# Altium schematic sheet Left.SchDoc
size A3; SheetNumber: 1; SheetTotal: 1
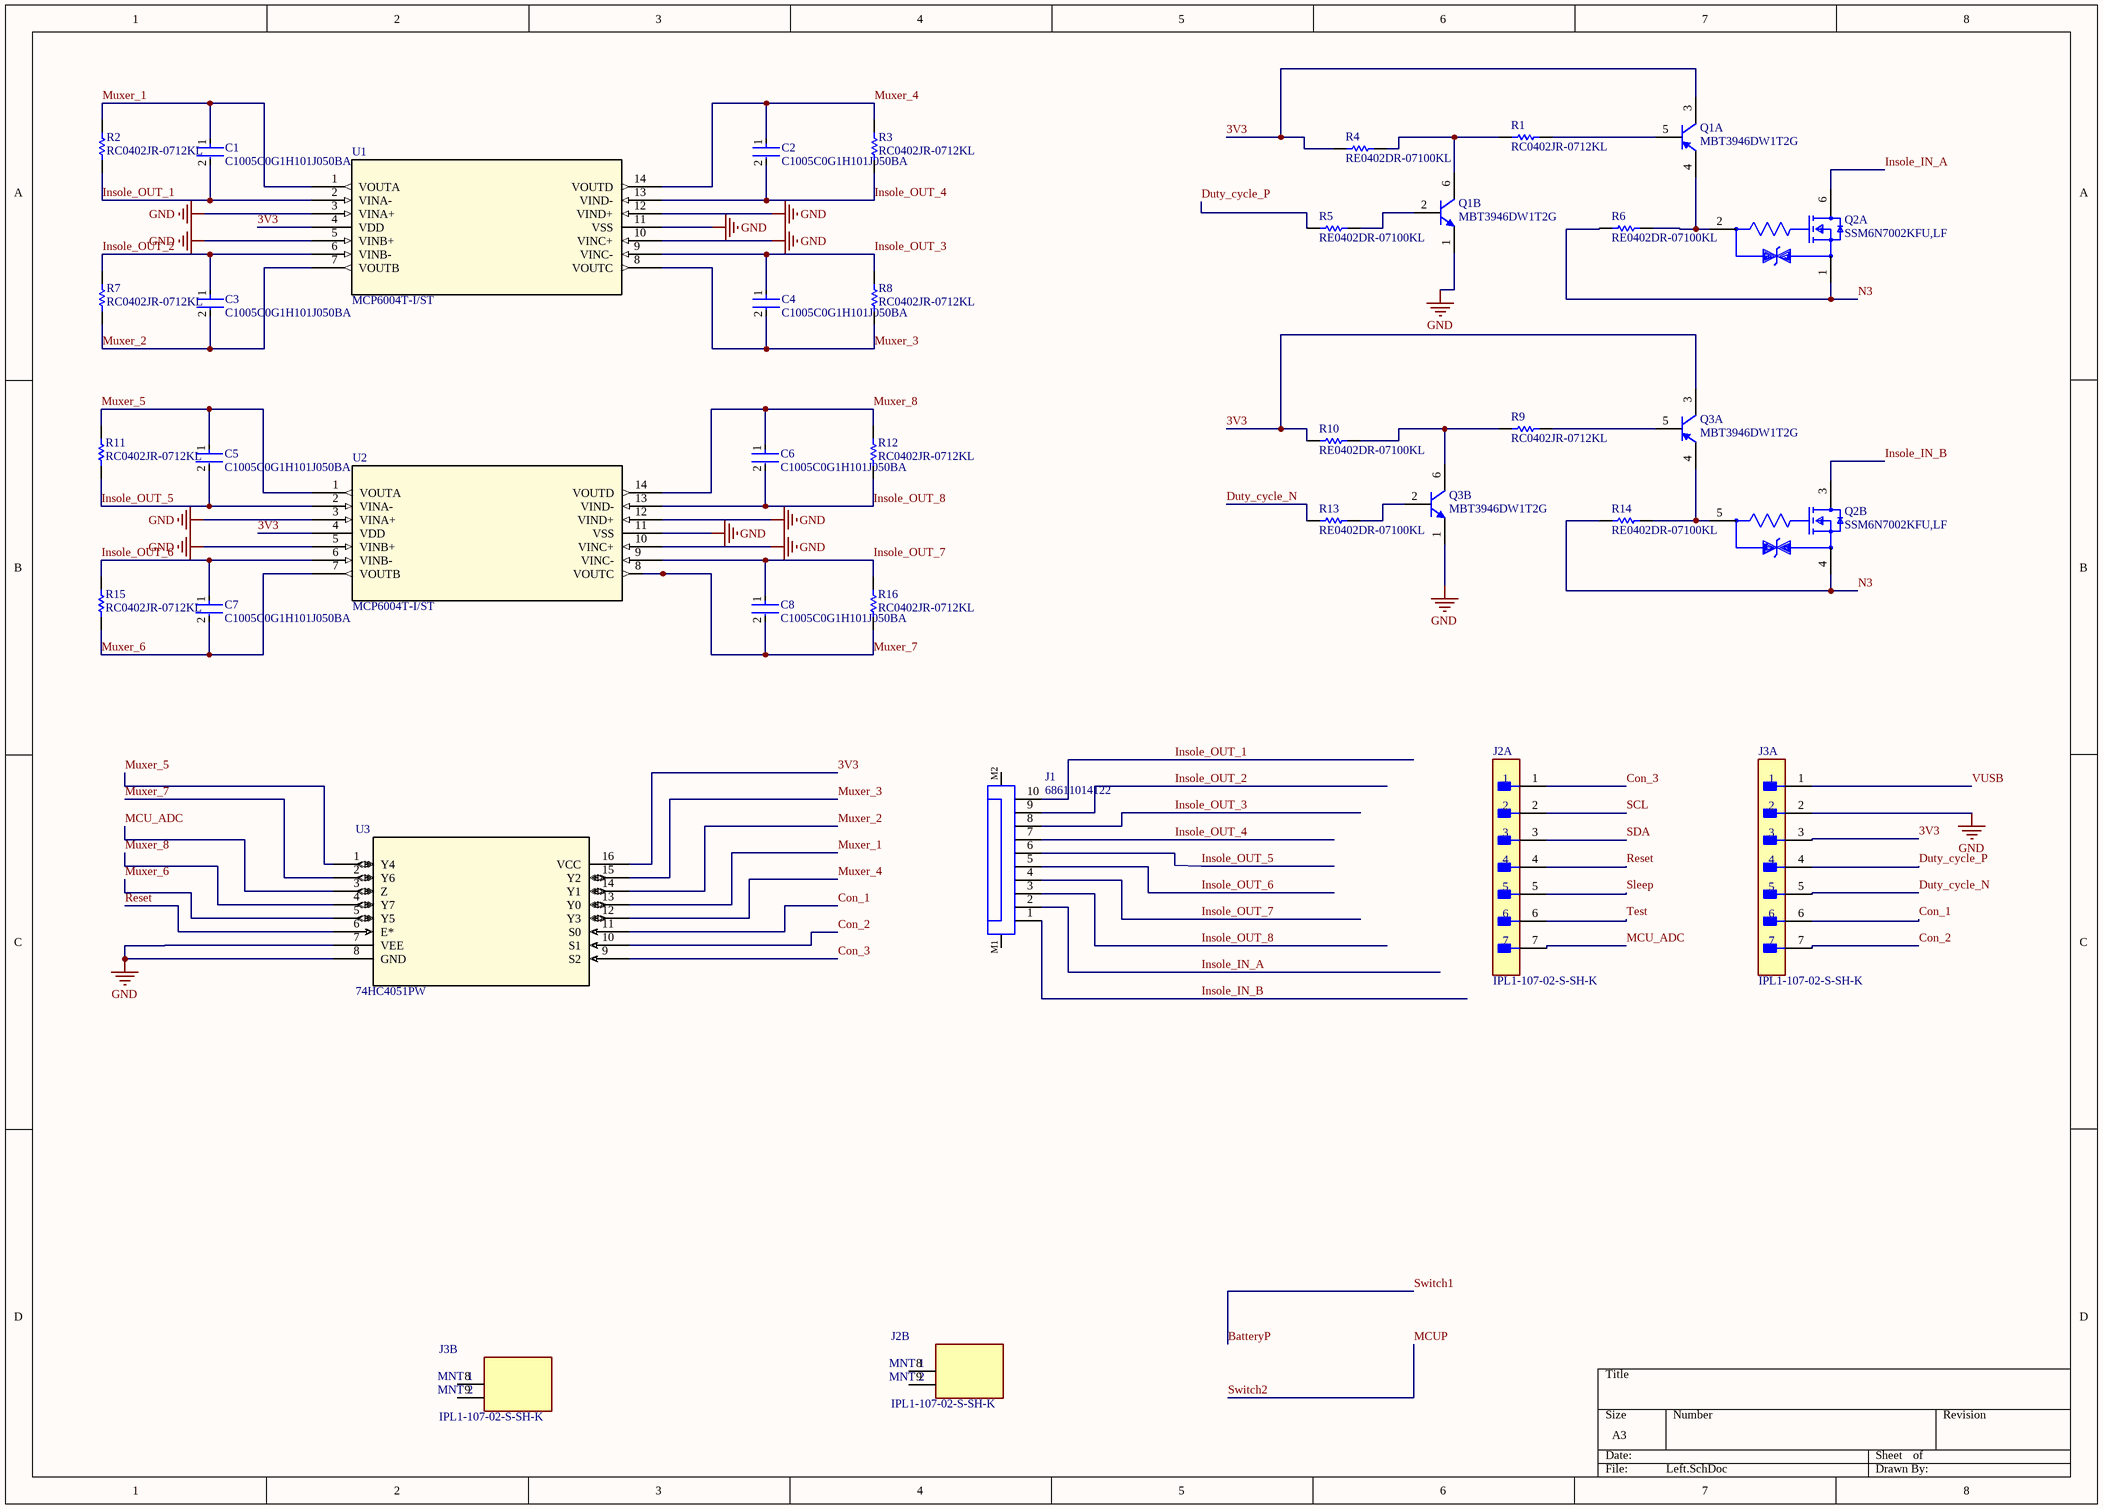
[diagram p0: Left.SchDoc]

## Parts
C1  C1005C0G1H101J050BA  [FP-C1005-050-0_05-MFG]
C2  C1005C0G1H101J050BA  [FP-C1005-050-0_05-MFG]
C3  C1005C0G1H101J050BA  [FP-C1005-050-0_05-MFG]
C4  C1005C0G1H101J050BA  [FP-C1005-050-0_05-MFG]
C5  C1005C0G1H101J050BA  [FP-C1005-050-0_05-MFG]
C6  C1005C0G1H101J050BA  [FP-C1005-050-0_05-MFG]
C7  C1005C0G1H101J050BA  [FP-C1005-050-0_05-MFG]
C8  C1005C0G1H101J050BA  [FP-C1005-050-0_05-MFG]
J1  68611014122  [68611014122]
J2  IPL1-107-02-S-SH-K  [FP-IPL1-107-02-S-SH-K-0]  (parts A,B of 2)
J3  IPL1-107-02-S-SH-K  [FP-IPL1-107-02-S-SH-K-0]  (parts A,B of 2)
Q1  MBT3946DW1T2G  [ONSC-SC70-6-419B-02_W_V]  (parts A,B of 2)
Q2  SSM6N7002KFU,LF  [FP-SSOP6-P-0_65A-MFG]  (parts A,B of 2)
Q3  MBT3946DW1T2G  [ONSC-SC70-6-419B-02_W_V]  (parts A,B of 2)
R1  RC0402JR-0712KL  [RESC1005X40X25NL05T10]
R2  RC0402JR-0712KL  [RESC1005X40X25NL05T10]
R3  RC0402JR-0712KL  [RESC1005X40X25NL05T10]
R4  RE0402DR-07100KL  [RESC1005X37X25ML05T10]
R5  RE0402DR-07100KL  [RESC1005X37X25ML05T10]
R6  RE0402DR-07100KL  [RESC1005X37X25ML05T10]
R7  RC0402JR-0712KL  [RESC1005X40X25NL05T10]
R8  RC0402JR-0712KL  [RESC1005X40X25NL05T10]
R9  RC0402JR-0712KL  [RESC1005X40X25NL05T10]
R10  RE0402DR-07100KL  [RESC1005X37X25ML05T10]
R11  RC0402JR-0712KL  [RESC1005X40X25NL05T10]
R12  RC0402JR-0712KL  [RESC1005X40X25NL05T10]
R13  RE0402DR-07100KL  [RESC1005X37X25ML05T10]
R14  RE0402DR-07100KL  [RESC1005X37X25ML05T10]
R15  RC0402JR-0712KL  [RESC1005X40X25NL05T10]
R16  RC0402JR-0712KL  [RESC1005X40X25NL05T10]
U1  MCP6004T-I/ST  [TSSOP14_MC_MCH]
U2  MCP6004T-I/ST  [TSSOP14_MC_MCH]
U3  74HC4051PW  [SOT403-1_NXP]

## Nets
GND: J3.2 Q1.1(E) Q3.1(E) U1.3(VINA+) U1.5(VINB+) U1.10(VINC+) U1.11(VSS) U1.12(VIND+) U2.3(VINA+) U2.5(VINB+) U2.10(VINC+) U2.11(VSS) U2.12(VIND+) U3.7(VEE) U3.8(GND)
3V3: J3.3 Q1.3(C) Q3.3(C) R4.2 R10.2 U1.4(VDD) U2.4(VDD) U3.16(VCC)
Con_1: J3.6 U3.11(S0)
Con_2: J3.7 U3.10(S1)
Con_3: J2.1 U3.9(S2)
Duty_cycle_N: J3.5 R13.2
Duty_cycle_P: J3.4 R5.2
Insole_IN_A: J1.2 Q2.6(Drain1)
Insole_IN_B: J1.1 Q2.3(Drain2)
Insole_OUT_1: C1.2 J1.10 R2.1 U1.2(VINA-)
Insole_OUT_2: C3.1 J1.9 R7.2 U1.6(VINB-)
Insole_OUT_3: C4.1 J1.8 R8.2 U1.9(VINC-)
Insole_OUT_4: C2.2 J1.7 R3.1 U1.13(VIND-)
Insole_OUT_5: C5.2 J1.6 R11.1 U2.2(VINA-)
Insole_OUT_6: C7.1 J1.5 R15.2 U2.6(VINB-)
Insole_OUT_7: C8.1 J1.4 R16.2 U2.9(VINC-)
Insole_OUT_8: C6.2 J1.3 R12.1 U2.13(VIND-)
MCU_ADC: J2.7 U3.3(Z)
Muxer_1: C1.1 R2.2 U1.1(VOUTA) U3.13(Y0)
Muxer_2: C3.2 R7.1 U1.7(VOUTB) U3.14(Y1)
Muxer_3: C4.2 R8.1 U1.8(VOUTC) U3.15(Y2)
Muxer_4: C2.1 R3.2 U1.14(VOUTD) U3.12(Y3)
Muxer_5: C5.1 R11.2 U2.1(VOUTA) U3.1(Y4)
Muxer_6: C7.2 R15.1 U2.7(VOUTB) U3.5(Y5)
Muxer_7: C8.2 R16.1 U2.8(VOUTC) U3.2(Y6)
Muxer_8: C6.1 R12.2 U2.14(VOUTD) U3.4(Y7)
N3: Q2.1(Source1) Q2.4(Source2) R6.2 R14.2
Reset: J2.4 U3.6(E*)
SCL: J2.2
SDA: J2.3
Sleep: J2.5
Test: J2.6
VUSB: J3.1
NetQ1_2: Q1.2(B) R5.1
NetQ1_4: Q1.4(E) Q2.2(Gate1) R6.1
NetQ1_5: Q1.5(B) R1.1
NetQ1_6: Q1.6(C) R1.2 R4.1
NetQ2_5: Q2.5(Gate2) Q3.4(E) R14.1
NetQ3_2: Q3.2(B) R13.1
NetQ3_5: Q3.5(B) R9.1
NetQ3_6: Q3.6(C) R9.2 R10.1

Not connected (* = marked no-connect by the designer): J1 M1 M2; J2 8(MNT_1) 9(MNT_2); J3 8(MNT_1) 9(MNT_2)

## Library data of the parts
C1-C8 = CMP-2000-05991-2: Multilayer Ceramic Capacitors 100pF ±5% 50V C0G SMD 0402; Temperature Coefficient: 30ppm/°C; Packaging: Tape and Reel; Number of Pins: 2; Construction: Flat; Capacitance: 100pF; Max Operating Temperature: 125°C; Depth: 0.5mm; Radiation Hardening: No; Length: 1mm; Mount: Surface Mount; Thickness: 0.022inch; RoHS Compliant: Yes; Width: 0.5mm; Termination: SMD/SMT; Min Operating Temperature: -55°C; Case/Package: 0402; Tolerance: 5%; Height: 0.5mm; Dielectric: C0G; REACH SVHC: No SVHC; Case Code (Imperial): 0402; Dielectric Material: Ceramic; Voltage Rating: 50V; Package Quantity: 1; Voltage Rating (DC): 50V; Weight: 2.3E-05oz; Series: C; Case Code (Metric): 1005; Voltage: 50V; Lead Free: Lead Free
J1 = CMP-1502-01471-2: 68611014122 FPC connect for left; NexarPartId: 8917682; Operating Supply Voltage: 125V; Contact Resistance: 20mΩ; Actuator Material: Polyphenylene; Insulation Resistance: 100MΩ; Pitch: 1mm; Number of Positions: 10; Gender: Male; Current Rating: 1A; Width: 2.95mm; RoHS: Compliant; Min Operating Temperature: -25°C; Voltage Rating: 125V; Contact Material: Bronze, Tin; Orientation: Horizontal; Packaging: Tape and Reel; Termination: Solder; Number of Pins: 10; Max Operating Temperature: 85°C; Flammability Rating: UL94 V-0; Number of Contacts: 10; Length: 17mm; Number of Rows: 1; Contact Plating: Tin; Housing Material: Polyphenylene; Mount: Surface Mount; Lead Pitch: 1mm; REACH SVHC: No SVHC
J2 J3 = CMP-02766-000183-1: 7 Position 1 Row .100" (2.54 mm) pitch connector; Number of Contacts: 7; Gender: Male; Pitch: 2.54mm; Radiation Hardening: No; Orientation: Right Angle; Mount: Surface Mount; Packaging: Bulk; Termination: Solder
Q1 Q3 = CMP-1048-00392-1: Complementary General Purpose Transistors, 6-Pin SC70, Pb-Free, Tape and Reel; Manufacturer: On Semiconductor; IC Continuous (A): 0.2; Packing: Tape and Reel; ComponentLink2URL: http://www.onsemi.com/pub_link/Collateral/MBT3946DW1T1-D.PDF; Mounting Technology: Surface Mount; PackageDescription: 6-Pin Small Outline Transistor, Body 2 x 1.25 mm, Pitch 0.65 mm; ComponentLink1URL: http://www.onsemi.com/; Polarity: Complementary; RoHS: TRUE; ComponentLink1Description: Manufacturer URL; ComponentLink3Description: Package Specification; DatasheetVersion: Rev. 7; PackageReference: SC70-6-419B-02_W; ComponentLink2Description: Datasheet; PackageVersion: Rev. W; PartNumber: MBT3946DW1T2G; ComponentLink3URL: http://www.onsemi.com/pub_link/Collateral/SMF05C-D.PDF
Q2 = CMP-35916-000009-1: MOSFET 2N-CH 60V 0.3A; Input Capacitance: 40pF; Continuous Drain Current (ID): 300mA; Max Power Dissipation: 285mW; FET Type: 2 N-Channel; Rds On Max: 1.5R; Mount: Surface Mount; Drain to Source Voltage (Vdss): 60V; Packaging: Tape and Reel
R1-R3 R7-R9 R11 R12 R15 R16 = CMP-2002-07921-1: 12K resistor; Manufacturer: Yageo / Phycomp; Part Number: RC0402JR-0712KL
R4-R6 R10 R13 R14 = CMP-2002-01850-1: 100K resistor; Manufacturer: Yageo / Phycomp; Part Number: RE0402DR-07100KL
U1 U2 = MCP6004T-I/ST: 4-channel operational amplifer; Mfr_Name: Microchip; Digi-Key_Part_Number_3: MCP6004T-I/STTR-ND; Digi-Key_Part_Number_2: MCP6004T-I/STDKR-ND; Digi-Key_Part_Number_1: MCP6004T-I/STCT-ND; RefDes: RefDes; Type: Type
U3 = 74HC4051PW: 8-channel analog multiplexer/demultiplexer; Mfr_Name: NXP; Copyright: Copyright (C) 2023 Ultra Librarian. All rights reserved.; Manufacturer_Part_Number: 74HC4051PW; Digi-Key_Part_Number_1: 568-2259-1-ND; Digi-Key_Part_Number_2: 568-2259-2-ND; Digi-Key_Part_Number_3: 568-2259-6-ND; Digi-Key_Part_Number_4: 568-8288-5-ND; RefDes: RefDes; Type: DEV